# EAGLE design PrototypeVar4(Compactimization) (EAGLE 7.4.0)
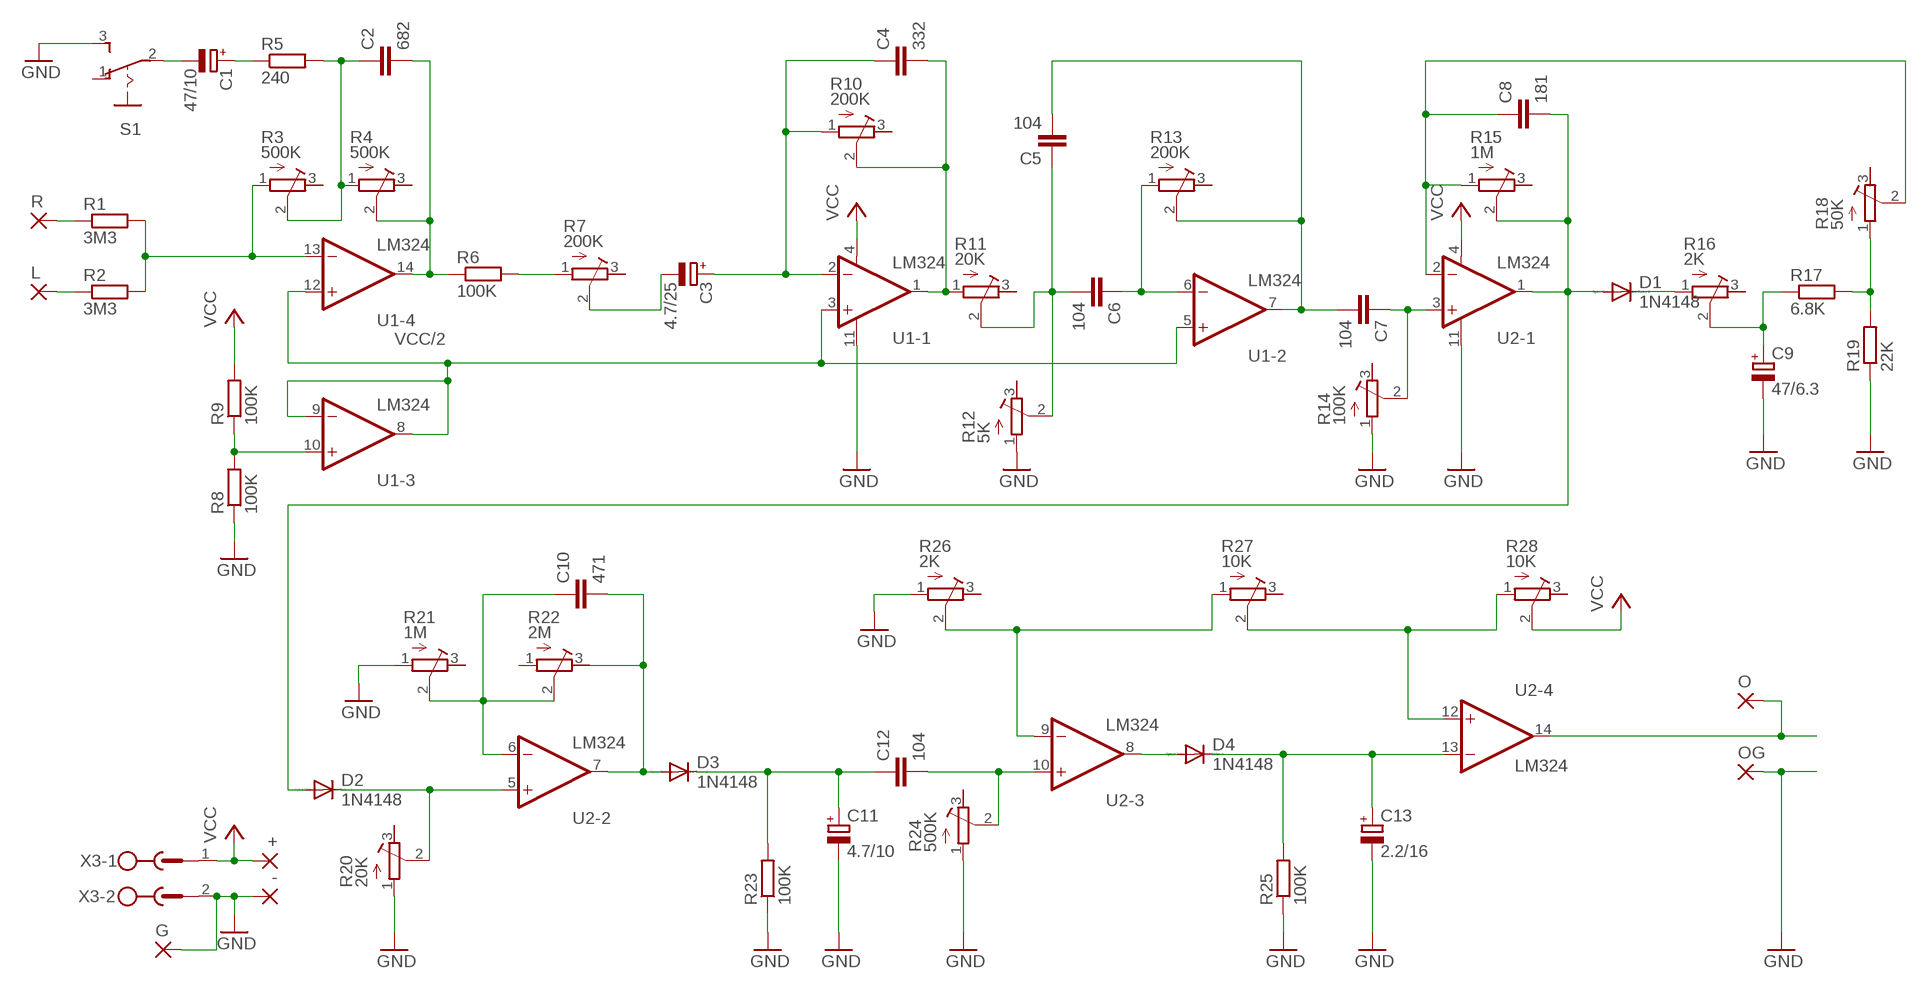
[diagram p0: schematic, sheet 1]

## Parts
+  1,6/0,9  [1,6/0,9]
-  1,6/0,9  [1,6/0,9]
C1  47/10  CPOL-EUE2.5-7  [E2,5-7]
C2  682  C-EU050-035X075  [C050-035X075]
C3  4.7/25  CPOL-EUE2.5-7  [E2,5-7]
C4  332  C-EU050-035X075  [C050-035X075]
C5  104  C-EU050-035X075  [C050-035X075]
C6  104  C-EU050-035X075  [C050-035X075]
C7  104  C-EU050-035X075  [C050-035X075]
C8  181  C-EU050-035X075  [C050-035X075]
C9  47/6.3  CPOL-EUE2.5-7  [E2,5-7]
C10  471  C-EU050-035X075  [C050-035X075]
C11  4.7/10  CPOL-EUE2.5-7  [E2,5-7]
C12  104  C-EU050-035X075  [C050-035X075]
C13  2.2/16  CPOL-EUE2.5-7  [E2,5-7]
D1  1N4148  1N4148DO35-10  [DO35-10]
D2  1N4148  1N4148DO35-10  [DO35-10]
D3  1N4148  1N4148DO35-10  [DO35-10]
D4  1N4148  1N4148DO35-10  [DO35-10]
G  1,6/0,9  [1,6/0,9]
L  1,6/0,9  [1,6/0,9]
O  1,6/0,9  [1,6/0,9]
OG  1,6/0,9  [1,6/0,9]
R  1,6/0,8  [1,6/0,8]
R1  3M3  R-EU_0207/10  [0207/10]
R2  3M3  R-EU_0207/10  [0207/10]
R3  500K  R-TRIMM64W  [RTRIM64W]
R4  500K  R-TRIMM64W  [RTRIM64W]
R5  240  R-EU_0207/10  [0207/10]
R6  100K  R-EU_0207/10  [0207/10]
R7  200K  R-TRIMM64W  [RTRIM64W]
R8  100K  R-EU_0207/10  [0207/10]
R9  100K  R-EU_0207/10  [0207/10]
R10  200K  R-TRIMM64W  [RTRIM64W]
R11  20K  R-TRIMM64W  [RTRIM64W]
R12  5K  R-TRIMM64W  [RTRIM64W]
R13  200K  R-TRIMM64W  [RTRIM64W]
R14  100K  R-TRIMM64W  [RTRIM64W]
R15  1M  R-TRIMM64W  [RTRIM64W]
R16  2K  R-TRIMM64W  [RTRIM64W]
R17  6.8K  R-EU_0207/10  [0207/10]
R18  50K  R-TRIMM64W  [RTRIM64W]
R19  22K  R-EU_0207/10  [0207/10]
R20  20K  R-TRIMM64W  [RTRIM64W]
R21  1M  R-TRIMM64W  [RTRIM64W]
R22  2M  R-TRIMM64W  [RTRIM64W]
R23  100K  R-EU_0207/10  [0207/10]
R24  500K  R-TRIMM64W  [RTRIM64W]
R25  100K  R-EU_0207/10  [0207/10]
R26  2K  R-TRIMM64W  [RTRIM64W]
R27  10K  R-TRIMM64W  [RTRIM64W]
R28  10K  R-TRIMM64W  [RTRIM64W]
S1  255SB  [255SB]
U1-  LM324  [SOIC-14]
U2-  LM324  [SOIC-14]
X3  MSTBV2  [MSTBV2]

## Nets
GND: -.1(P) C9.- C11.- C13.- G.1(P) OG.1(P) R8.1 R12.1(A) R14.1(A) R19.1 R20.1(A) R21.1(A) R23.1 R24.1(A) R25.1 R26.1(A) S1.3(S) U1-.11(1:V-) U2-.11(1:V-) X3.2
N$1: C3.+ C4.1 R10.1(A) U1-.2(1:-IN)
N$2: C4.2 R10.2(S) R11.1(A) U1-.1(1:OUT)
N$3: C5.1 C6.2 R11.2(S) R12.2(S)
N$4: C5.2 C7.2 R13.2(S) U1-.7(2:OUT)
N$5: C7.1 R14.2(S) U2-.3(1:+IN)
N$6: C6.1 R13.1(A) U1-.6(2:-IN)
N$7: C8.1 R15.1(A) R18.2(S) U2-.2(1:-IN)
N$8: D1.C R16.1(A)
N$9: C1.+ R5.1
N$10: C9.+ R16.2(S) R17.1
N$11: C2.2 R4.2(S) R6.1 U1-.14(4:OUT)
N$12: D2.C R20.2(S) U2-.5(2:+IN)
N$13: C10.1 R21.2(S) R22.2(S) U2-.6(2:-IN)
N$14: C2.1 R3.2(S) R4.1(A) R5.2
N$15: C10.2 D3.A R22.3(E) U2-.7(2:OUT)
N$16: C11.+ C12.1 D3.C R23.2
N$17: C12.2 R24.2(S) U2-.10(3:+IN)
N$18: D4.A U2-.8(3:OUT)
N$19: C13.+ D4.C R25.2 U2-.13(4:-IN)
N$20: R26.2(S) R27.1(A) U2-.9(3:-IN)
N$21: R27.2(S) R28.1(A) U2-.12(4:+IN)
N$22: R1.1 R.1(P)
N$23: R17.2 R18.1(A) R19.2
N$24: R8.2 R9.1 U1-.10(3:+IN)
N$25: R6.2 R7.1(A)
N$26: C3.- R7.2(S)
N$27: O.1(P) U2-.14(4:OUT)
N$29: C1.- S1.2(P)
N$30: R1.2 R2.2 R3.1(A) U1-.13(4:-IN)
N$31: L.1(P) R2.1
U2-: C8.2 D1.A D2.A R15.2(S) U2-.1(1:OUT)
VCC: +.1(P) R9.2 R28.2(S) U1-.4(1:V+) U2-.4(1:V+) X3.1
VCC/2: U1-.3(1:+IN) U1-.5(2:+IN) U1-.8(3:OUT) U1-.9(3:-IN) U1-.12(4:+IN)
Unconnected: R3.3(E) R4.3(E) R7.3(E) R10.3(E) R11.3(E) R12.3(E) R13.3(E) R14.3(E) R15.3(E) R16.3(E) R18.3(E) R20.3(E) R21.3(E) R22.1(A) R24.3(E) R26.3(E) R27.3(E) R28.3(E) S1.1(O)

## Library data of the parts
+ - G L O OG = wirepad:1,6/0,9: THROUGH-HOLE PAD
C1 C3 C9 C11 C13 = resistor:CPOL-EU: POLARIZED CAPACITOR, European symbol
C2 C4-C8 C10 C12 = resistor:C-EU: CAPACITOR, European symbol
D1-D4 = diode:1N4148: DIODE high speed (Philips)
R = wirepad:1,6/0,8: THROUGH-HOLE PAD
R1 R2 R5 R6 R8 R9 R17 R19 R23 R25 = resistor:R-EU_: RESISTOR, European symbol
R3 R4 R7 R10-R16 R18 R20-R22 R24 R26-R28 = resistor:R-TRIMM: Trimm resistor
S1 = switch:255SB: SLIDING SWITCH Distributor Buerklin, 11G810
U1- U2- = seanvoisen:LM324: LM324 Quad Op-amp
X3 = con-phoenix-500:MSTBV2: PHOENIX; OC_FARNELL: unknown; OC_NEWARK: unknown

## Board
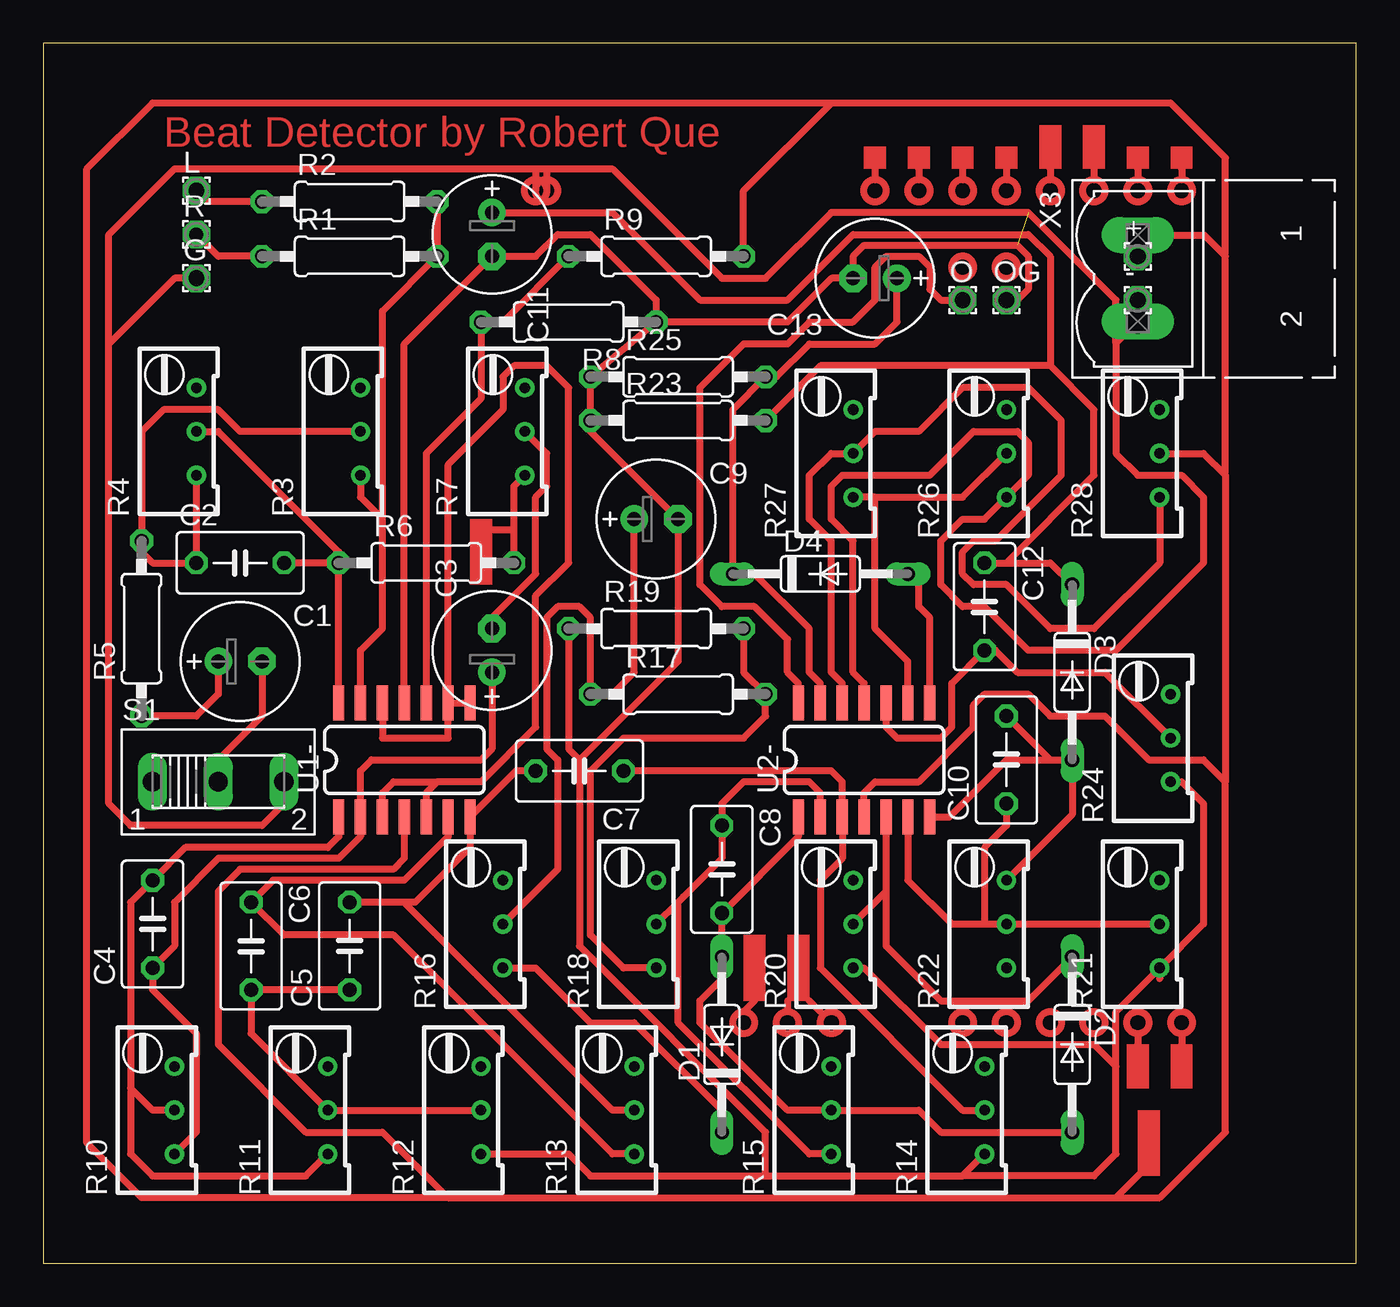
[diagram p1: board, top side]

Size 76.18 x 70.79 mm. Coordinates in mm from the lower left corner, seen from the top.
Outline: 0,0 76.18,0 76.18,70.79 0,70.79 0,0
Copper layers (1*16): Top 0.035mm / dielectric 1.5mm / Bottom 0.035mm
Design rules "default": minimum track width 10mil, minimum drill 24mil, track to track 8mil, track to pad 8mil, pad to pad 8mil, via to via 8mil, smd to smd 8mil, copper to edge 40mil, drill to drill 8mil, minimum pad ring 10mil, minimum via ring 8mil, stop-mask expansion 4mil, vias tented up to drill 0mil, thermal gap 10mil

### Footprints (pad centres in the part's own frame; a part is rotated, then mirrored left to right if it is on the bottom)
1,6/0,9 = drill 0.914 pad 1.6 octagon: 1 0,0
E2,5-7 = drill 0.813 pad 1.6: + -1.27,0 | drill 0.813 pad 1.6 octagon: - 1.27,0
C050-035X075 = drill 0.813 octagon: 1 -2.54,0; 2 2.54,0
DO35-10 = drill 0.813 long: A 5.08,0; C -5.08,0
1,6/0,8 = drill 0.813 pad 1.6 octagon: 1 0,0
0207/10 = drill 0.813 octagon: 1 -5.08,0; 2 5.08,0
RTRIM64W = drill 0.61: 1 1.27,-2.54; 2 1.27,0; 3 1.27,2.54
255SB = drill 1.118 long: 1 -3.81,0; 2 0,0; 3 3.81,0
SOIC-14 = smd 0.66 x 2.032: 1 -4.445,-3.315; 2 -3.175,-3.315; 3 -1.905,-3.315; 4 -0.635,-3.315; 5 0.635,-3.315; 6 1.905,-3.315; 7 3.175,-3.315; 8 3.175,3.315; 9 1.905,3.315; 10 0.635,3.315; 11 -0.635,3.315; 12 -1.905,3.315; 13 -3.175,3.315; 14 -4.445,3.315
MSTBV2 = drill 1.397 long: 1 -2.5,0; 2 2.5,0

### Placement (x,y rotation side)
+  63.5,58.42 0 top
-  63.5,55.88 0 top
C1  11.43,34.92 0 top
C2  11.43,40.64 0 top
C3  26.04,35.56 90 top
C4  6.35,19.68 90 top
C5  17.78,18.42 90 top
C6  12.07,18.42 270 top
C7  31.11,28.57 180 top
C8  39.37,22.86 270 top
C9  35.56,43.18 0 top
C10  55.88,29.21 90 top
C11  26.04,59.69 270 top
C12  54.61,38.1 270 top
C13  48.26,57.15 180 top
D1  39.37,12.7 90 top
D2  59.69,12.7 270 top
D3  59.69,34.29 270 top
D4  45.09,40 0 top
G  8.89,57.15 0 top
L  8.89,62.23 0 top
O  53.34,55.88 0 top
OG  55.88,55.88 0 top
R  8.89,59.69 0 top
R1  17.78,58.42 0 top
R2  17.78,61.59 0 top
R3  17.14,48.26 0 top
R4  7.62,48.26 0 top
R5  5.71,36.83 90 top
R6  22.22,40.64 0 top
R7  26.67,48.26 0 top
R8  30.48,54.61 180 top
R9  35.56,58.42 0 top
R10  6.35,8.89 0 top
R11  15.24,8.89 0 top
R12  24.13,8.89 0 top
R13  33.02,8.89 0 top
R14  53.34,8.89 0 top
R15  44.45,8.89 0 top
R16  25.4,19.68 0 top
R17  36.83,33.02 0 top
R18  34.29,19.68 0 top
R19  35.56,36.83 0 top
R20  45.72,19.68 0 top
R21  63.5,19.68 0 top
R22  54.61,19.68 0 top
R23  36.83,48.89 0 top
R24  64.14,30.48 0 top
R25  36.83,51.44 0 top
R26  54.61,46.99 0 top
R27  45.72,46.99 0 top
R28  63.5,46.99 0 top
S1  10.16,27.94 0 top
U1-  21.59,29.21 0 top
U2-  48.26,29.21 0 top
X3  63.5,57.15 270 top

### Tracks (layer width: path | path; a pad name or v marks a point on that pad's centre or on a via)
GND  (1 unrouted)
  Top 0.406: R8.1 R25.1 R23.1 31.75,48.26 C9.- 36.83,34.92 31.11,29.21 | R12.1 30.48,6.35 31.75,5.08 41.91,5.08 | 41.91,5.08 53.34,5.08 | 53.34,5.08 R14.1 | 62.23,53.38 62.23,46.99 63.5,45.72 66.04,45.72 67.31,44.45 67.31,40.64 62.23,35.56 57.15,35.56 54.61,38.1 53.34,38.1 52.07,39.37 52.07,41.91 53.34,43.18 54.61,43.18 R26.1 57.15,45.72 57.15,47.62 56.52,48.26 53.98,48.26 51.44,45.72 46.36,45.72 45.72,45.08 45.72,43.18 46.99,41.91 46.99,34.29 47.62,33.66 U2-.11 | R20.1 47.62,17.14 52.07,12.7 60.96,12.7 62.23,11.43 | R24.1 66.04,27.94 67.31,26.67 67.31,19.68 R21.1 | R21.1 64.77,16.51 | 53.34,5.08 60.96,5.08 62.23,6.35 62.23,11.43 | U1-.11 20.96,53.34 C11.- 28.57,58.42 29.84,59.69 31.75,59.69 35.56,55.88 R8.1 | 31.11,29.21 31.11,18.42 41.91,7.62 41.91,5.08 | R19.1 30.48,29.85 31.11,29.21 | S1.3 13.97,26.67 12.7,25.4 5.08,25.4 3.81,26.67 3.81,53.34 | 3.81,53.34 3.81,59.69 7.62,63.5 28.57,63.5 | 28.57,63.5 29.21,63.5 | 29.21,63.5 33.02,63.5 39.37,57.15 41.91,57.15 45.72,60.96 57.15,60.96 62.23,55.88 62.23,53.38 | G.1 7.62,57.15 3.81,53.34 | 62.23,53.38 X3.2 -.1 | R8.1 43.18,54.61 45.72,57.15 C13.- 46.99,58.42 47.62,59.05 56.52,59.05 57.15,58.42 57.15,56.52 56.52,55.88 OG.1 | 62.23,11.43 62.23,14.61 R21.1 | 29.21,63.5 29.21,62.23 | 28.57,63.5 28.57,62.23
N$1
  Top 0.406: C3.+ 26.04,29.85 25.4,29.21 19.05,29.21 18.41,28.57 U1-.2 18.41,24.76 17.14,23.5 10.16,23.5 7.62,20.96 7.62,18.42 C4.1 6.35,15.88 8.89,13.33 8.89,7.62 R10.1
N$2
  Top 0.406: R11.1 15.24,5.08 6.35,5.08 5.08,6.35 5.08,10.16 | U1-.1 17.14,24.76 16.51,24.13 8.25,24.13 C4.2 5.08,20.96 5.08,10.16 | R10.2 6.35,8.89 5.08,10.16
N$3
  Top 0.406: C5.1 C6.2 12.07,13.33 R11.2 R12.2
N$4
  Top 0.406: C7.2 27.44,28.57 U1-.7 24.76,24.13 21.59,20.96 20.96,20.96 | 20.96,20.96 C5.2 | R13.2 33.02,8.89 20.96,20.96
N$5
  Top 0.406: R14.2 53.34,8.89 45.09,17.14 45.09,22.22 46.36,23.5 U2-.3 46.36,27.94 45.72,28.57 C7.1
N$6
  Top 0.406: R13.1 33.02,6.35 20.32,19.05 13.97,19.05 C6.1 13.33,22.22 20.96,22.22 23.5,24.76 U1-.6
N$7
  Top 0.406: U2-.2 45.09,27.31 44.45,27.94 40.64,27.94 39.37,26.67 C8.1 39.37,23.5 37.15,21.27 36.83,20.96 | R15.1 44.45,6.35 36.83,13.97 36.83,20.96 | R18.2 36.83,20.96
N$8
  Top 0.406: R16.1 28.57,17.14 31.75,13.97 34.29,13.97 39.37,8.89 D1.C
N$9
  Top 0.406: C1.+ 10.16,33.02 8.89,31.75 R5.1
N$10
  Top 0.406: C9.+ 34.29,34.29 33.02,33.02 R17.1 31.75,37.47 31.11,38.1 29.84,38.1 29.21,37.47 29.21,29.85 29.84,29.21 29.84,22.86 R16.2
N$11
  Top 0.406: R6.1 C2.2 | U1-.14 R6.1 | R4.2 10.16,48.26 17.14,41.28 R6.1
N$12
  Top 0.406: U2-.5 48.89,21.59 | 48.89,21.59 R20.2 | 48.89,21.59 48.89,18.42 52.07,15.24 57.15,15.24 D2.C
N$13
  Top 0.406: R21.2 R22.2 54.61,19.68 | U2-.6 50.17,22.22 52.7,19.68 54.61,19.68 | C10.1 55.88,25.4 54.61,24.13 54.61,19.68
N$14
  Top 0.406: R3.2 11.43,48.26 10.16,49.53 6.98,49.53 5.71,48.26 R5.2 5.71,41.28 6.35,40.64 C2.1 R4.1
N$15
  Top 0.406: D3.A 59.69,26.04 R22.3 | C10.2 58.42,29.21 D3.A | U2-.7 52.56,25.89 55.88,29.21 D3.A
N$16
  Top 0.406: D3.C 58.42,40.64 C12.1 55.88,40.64 60.96,45.72 60.96,49.53 58.42,52.07 | R23.2 45.09,52.07 58.42,52.07 | 58.42,52.07 58.42,58.42 57.15,59.69 46.99,59.69 43.18,55.88 38.1,55.88 33.02,60.96 C11.+
N$17
  Top 0.406: U2-.10 48.89,31.11 49.53,30.48 52.07,30.48 52.7,31.11 52.7,33.66 C12.2 55.25,35.56 56.52,34.29 61.59,34.29 R24.2
N$18
  Top 0.406: U2-.8 51.44,37.47 50.8,38.1 50.8,39.37 D4.A
N$19
  Top 0.406: U2-.13 45.09,33.66 44.45,34.29 44.45,36.83 41.28,40 D4.C 40,49.53 R25.2 42.55,51.44 44.45,53.34 48.26,53.34 49.53,54.61 C13.+
N$20
  Top 0.406: 48.26,44.45 R27.1 | U2-.9 50.17,34.92 48.26,36.83 48.26,44.45 | 48.26,44.45 53.34,44.45 R26.2
N$21
  Top 0.406: U2-.12 46.36,33.66 45.72,34.29 45.72,41.91 44.45,43.18 44.45,45.72 45.72,46.99 R27.2 48.26,48.26 50.8,48.26 53.34,50.8 57.15,50.8 59.06,48.89 59.06,45.72 55.25,41.91 53.98,41.91 53.34,41.28 53.34,40 53.98,39.37 55.88,39.37 58.42,36.83 60.96,36.83 64.77,40.64 R28.1
N$22
  Top 0.406: R1.1 10.16,58.42 R.1
N$23
  Top 0.406: R19.2 40.64,34.29 R17.2 41.91,31.75 40.64,30.48 33.66,30.48 31.75,28.57 31.75,19.05 33.66,17.14 R18.1
N$24
  Top 0.406: U1-.10 22.22,46.99 25.4,50.16 R8.2 26.67,54.61 R9.1
N$25
  Top 0.406: R6.2 27.3,42.55 | 27.3,42.55 27.3,45.08 R7.1 | 27.3,42.55 26.04,42.55
N$26
  Top 0.406: R7.2 29.21,46.99 29.21,45.08 28.57,44.45 28.57,40 26.04,37.47 C3.-
N$27
  Top 0.406: U2-.14 43.81,33.66 43.18,34.29 43.18,36.19 41.28,38.1 39.37,38.1 38.1,39.37 38.1,50.8 40.64,53.34 43.18,53.34 44.45,54.61 46.99,54.61 48.26,55.88 48.26,57.78 48.89,58.42 50.8,58.42 51.44,57.78 51.44,56.52 52.07,55.88 O.1
N$28
  Top 0.406: 66.04,13.33 66.04,12.7 | 63.5,13.33 63.5,12.7
N$29
  Top 0.406: C1.- 12.7,31.75 10.16,29.21 S1.2
N$30
  Top 0.406: R2.2 R1.2 19.68,55.24 19.68,43.18 | U1-.13 18.41,35.56 19.68,36.83 19.68,43.18 | R3.1 18.41,44.45 19.68,43.18
N$31
  Top 0.406: R2.1 9.53,61.59 L.1
N$32
  Top 0.406: 60.96,63.5 60.96,62.86 | 63.5,63.5 63.5,62.86 | 66.04,63.5 66.04,62.86
N$33
  Top 0.406: 58.42,63.5 58.42,62.86 | 48.26,63.5 48.26,62.86 | 50.8,63.5 50.8,62.86 | 53.34,63.5 53.34,62.86 | 55.88,63.5 55.88,62.86
N$34
  Top 0.406: 44.45,15.24 45.09,14.61
N$35
  Top 0.406: 43.18,15.24 43.18,14.61
N$36
  Top 0.406: 41.28,15.24 40.64,14.61
U2-  (1 unrouted)
  Top 0.406: U2-.1 43.81,24.76 C8.2 D1.A 39.37,16.51 38.1,15.24 38.1,13.97 43.18,8.89 R15.2 50.8,8.89 52.07,7.62 D2.A
VCC
  Top 0.406: U2-.4 47.62,27.31 48.26,27.94 50.8,27.94 53.98,31.11 53.98,32.39 54.61,33.02 57.15,33.02 58.42,31.75 61.59,31.75 64.14,29.21 67.31,29.21 68.58,27.94 | 23.5,3.81 62.23,3.81 | 62.23,3.81 64.77,3.81 68.58,7.62 68.58,27.94 | 68.58,45.72 68.58,27.94 | R28.2 67.31,46.99 68.58,45.72 | U1-.4 20.96,23.5 20.32,22.86 11.43,22.86 10.16,21.59 10.16,12.7 15.24,7.62 19.68,7.62 23.5,3.81 | 23.5,3.81 5.71,3.81 2.54,6.98 2.54,63.5 6.35,67.31 45.72,67.31 | 68.58,45.72 68.58,58.42 | 68.58,58.42 68.58,64.13 65.41,67.31 45.72,67.31 | 68.58,58.42 67.35,59.65 X3.1 +.1 | R9.2 40.64,62.23 45.72,67.31 | 64.14,6.98 64.14,5.71 62.23,3.81
VCC/2
  Top 0.406: U1-.12 19.68,30.48 23.5,30.48 U1-.9 | U1-.9 U1-.8 | U1-.9 23.5,46.35 26.67,49.53 26.67,51.44 27.3,52.07 29.21,52.07 30.48,50.8 30.48,40.64 28.57,38.73 28.57,31.11 25.4,27.94 22.86,27.94 | 22.86,27.94 22.22,27.31 U1-.5 | U1-.3 19.68,27.31 20.32,27.94 22.86,27.94
(copper drawn outside any net)
  shapes: Top area x14, Top circle x21

### Text on the board
Top: Beat Detector by Robert Que